# Altium project MainBoard.PrjPcb
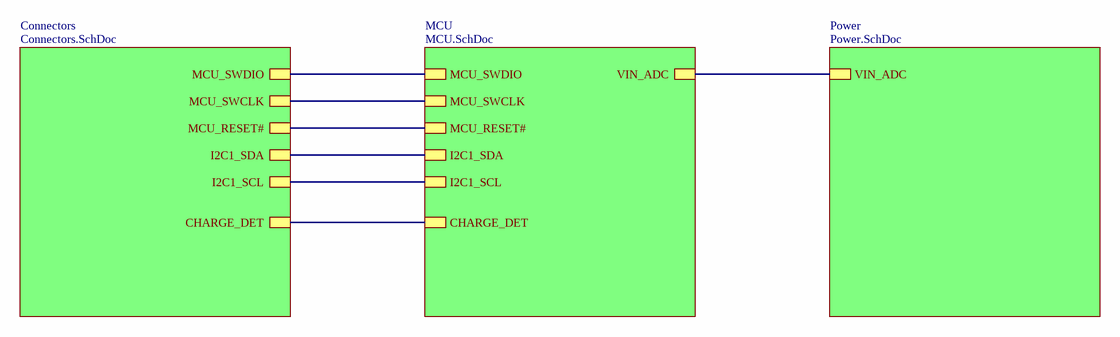
[diagram p0: Main.SchDoc]
ProjectAuthor: NeoProg; ProjectRevision: 1.00; ProjectStatus: D
4 sheets, 43 parts. Net scope: hierarchical (ports join the sheet entries above them; power ports are global).
Board file: PCB.PcbDoc
Sheets:
  Main.SchDoc
    Connectors = Connectors.SchDoc
    MCU = MCU.SchDoc
    Power = Power.SchDoc

## Sheet Main.SchDoc
size A3; SheetNumber: 1; SheetTotal: 1

### Sub-sheets
Connectors = Connectors.SchDoc: MCU_SWDIO, MCU_SWCLK, MCU_RESET#, CHARGE_DET, I2C1_SDA, I2C1_SCL
MCU = MCU.SchDoc: MCU_SWDIO, MCU_SWCLK, MCU_RESET#, VIN_ADC, CHARGE_DET, I2C1_SDA, I2C1_SCL
Power = Power.SchDoc: VIN_ADC

### Nets
CHARGE_DET: sheet Connectors/CHARGE_DET, sheet MCU/CHARGE_DET
I2C1_SCL: sheet Connectors/I2C1_SCL, sheet MCU/I2C1_SCL
I2C1_SDA: sheet Connectors/I2C1_SDA, sheet MCU/I2C1_SDA
MCU_RESET#: sheet Connectors/MCU_RESET#, sheet MCU/MCU_RESET#
MCU_SWCLK: sheet Connectors/MCU_SWCLK, sheet MCU/MCU_SWCLK
MCU_SWDIO: sheet Connectors/MCU_SWDIO, sheet MCU/MCU_SWDIO
VIN_ADC: sheet MCU/VIN_ADC, sheet Power/VIN_ADC

## Sheet Connectors.SchDoc
size A4; SheetNumber: 1; SheetTotal: 1
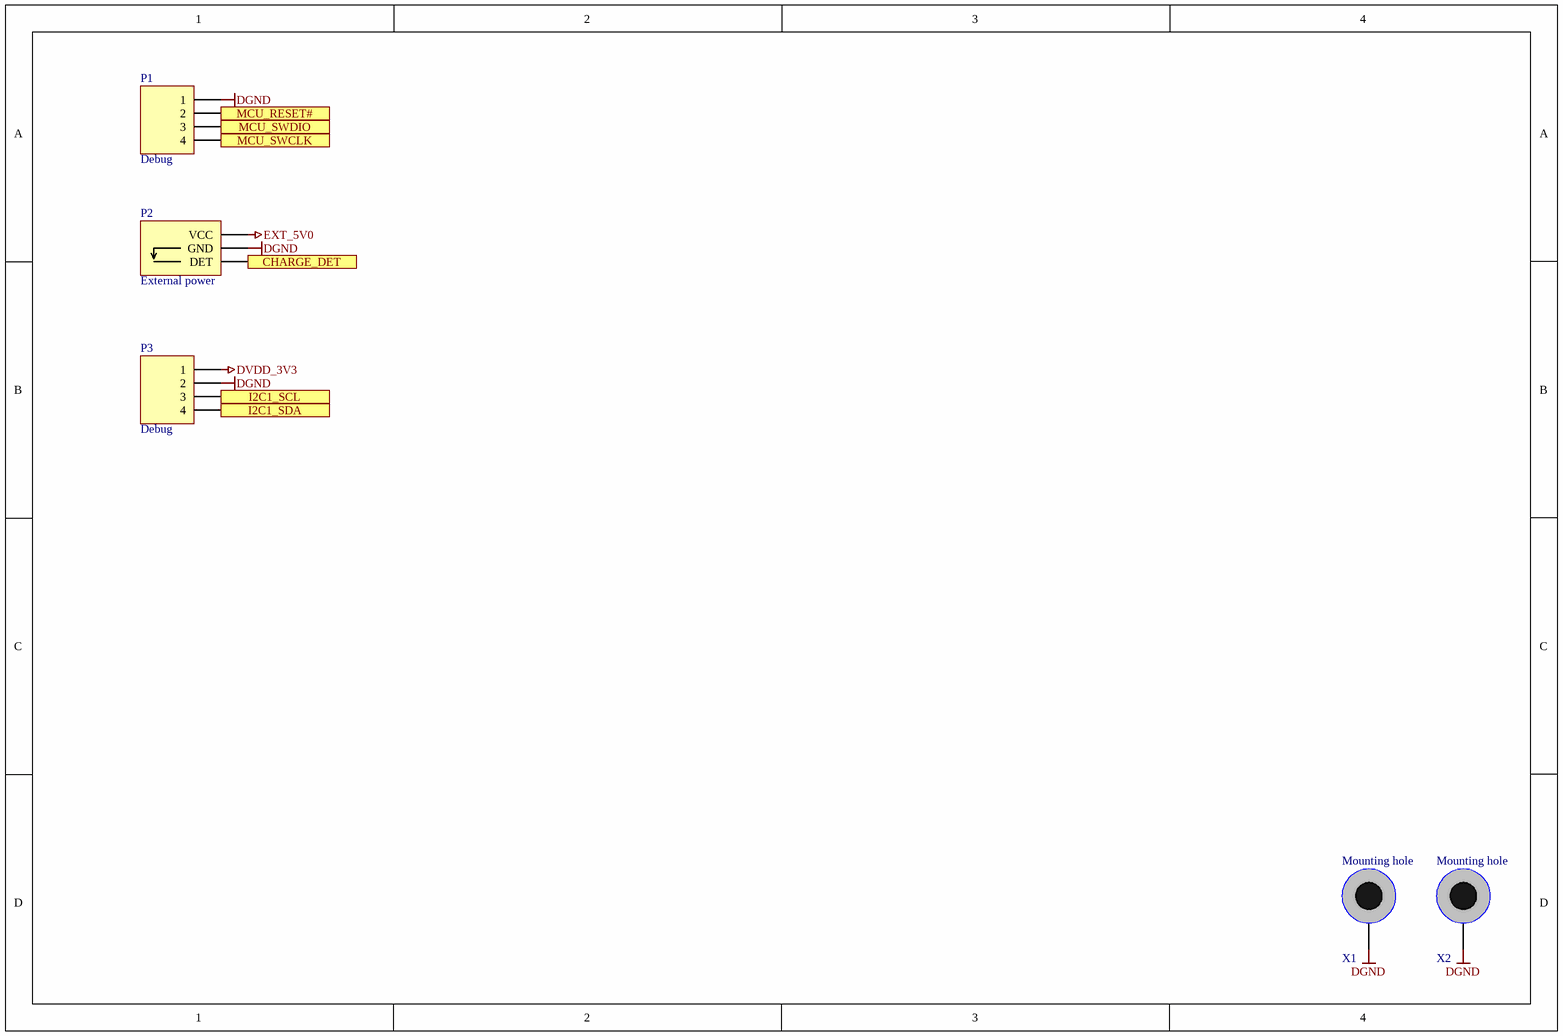
[diagram p1: Connectors.SchDoc]

### Parts
P1  Debug  [PLS-4 2.54]
P2  External power  [DC-210]
P3  Debug  [PLS-4 2.54]
X1  Mounting hole  [HOLE_M2_D4.0/2.5]  (no BOM)
X2  Mounting hole  [HOLE_M2_D4.0/2.5]  (no BOM)

### Ports
CHARGE_DET, I2C1_SCL, I2C1_SDA, MCU_RESET#, MCU_SWCLK, MCU_SWDIO

### Nets
DGND: P1.1 P2.2(GND) P3.2 X1.1 X2.1
DVDD_3V3: P3.1
EXT_5V0: P2.1(VCC)
CHARGE_DET: P2.3(DET) ; port CHARGE_DET
I2C1_SCL: P3.3 ; port I2C1_SCL
I2C1_SDA: P3.4 ; port I2C1_SDA
MCU_RESET#: P1.2 ; port MCU_RESET#
MCU_SWCLK: P1.4 ; port MCU_SWCLK
MCU_SWDIO: P1.3 ; port MCU_SWDIO

### Library data of the parts
P1 P3 = Header 4: Header, 4-Pin; LatestRevisionDate: 17-Jul-2002; LatestRevisionNote: Re-released for DXP Platform.; Publisher: Altium Limited
P2 = DC-210: Power connector 3.5mm; LatestRevisionDate: 17-Jul-2002; LatestRevisionNote: Re-released for DXP Platform.; Publisher: Altium Limited
X1 X2 = Mounting hole: Hole for screw M3, outline D6

## Sheet MCU.SchDoc
size A4; SheetNumber: 1; SheetTotal: 1
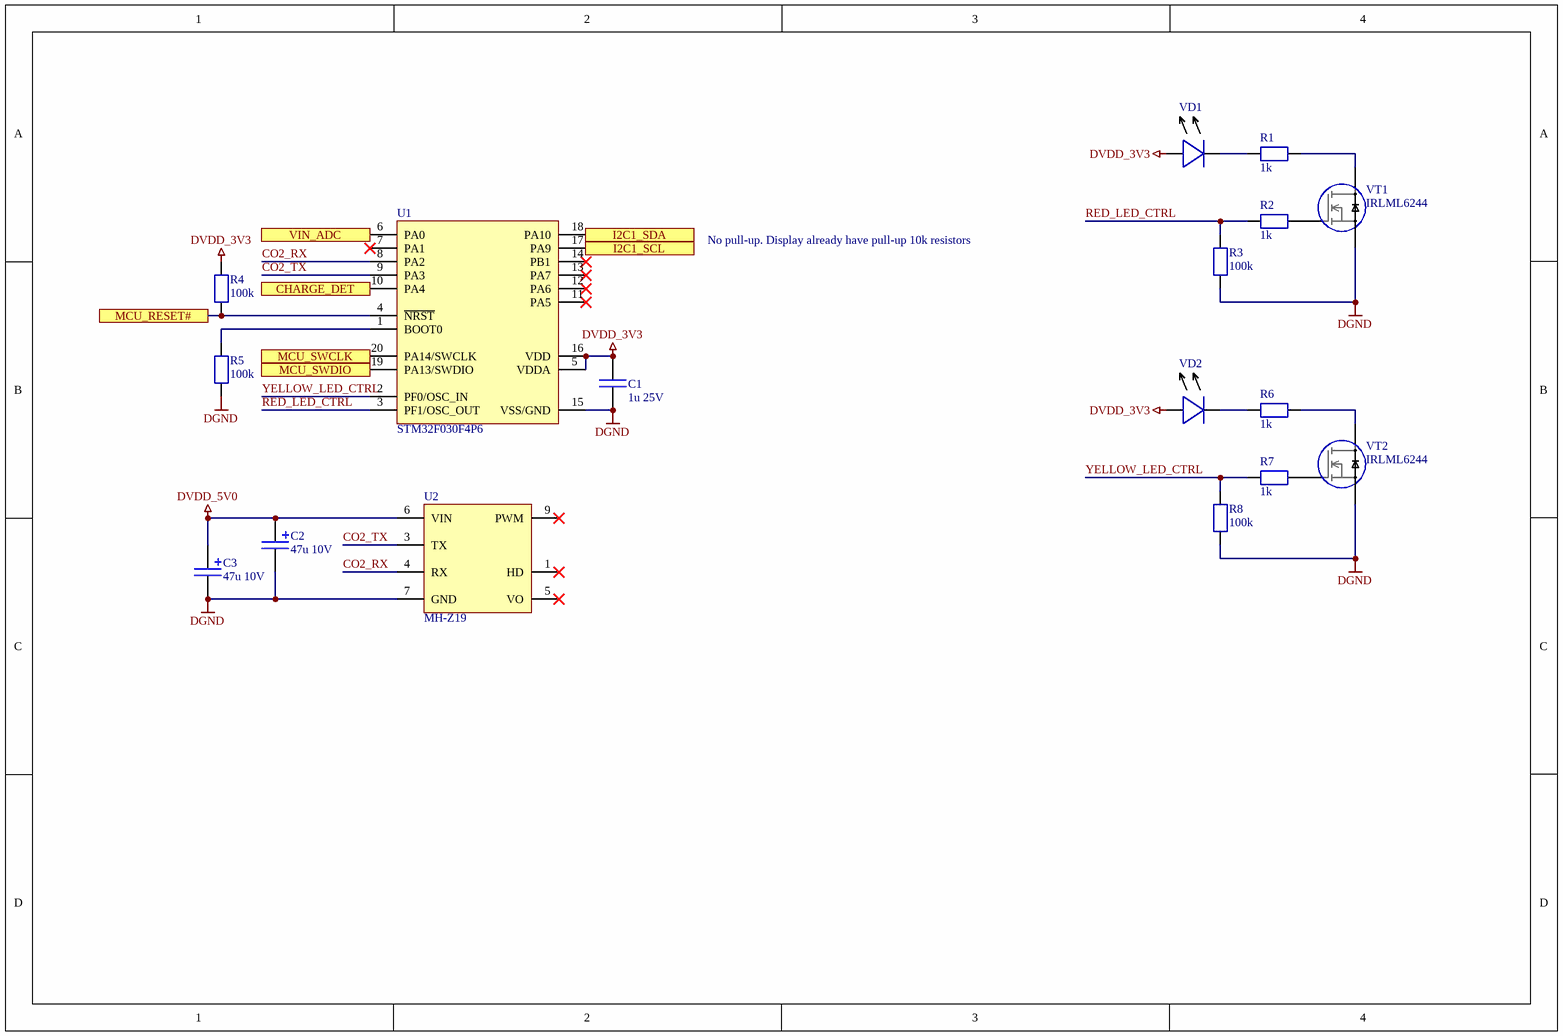
[diagram p2: MCU.SchDoc]

### Parts
C1  1u 25V  [C_0603/1608]
C2  47u 10V  [TECAP_TYPE_B]
C3  47u 10V  [TECAP_TYPE_B]
R1  1k  [R_0603/1608]
R2  1k  [R_0603/1608]
R3  100k  [R_0603/1608]
R4  100k  [R_0603/1608]
R5  100k  [R_0603/1608]
R6  1k  [R_0603/1608]
R7  1k  [R_0603/1608]
R8  100k  [R_0603/1608]
U1  STM32F030F4P6  [SO20_0.65]
U2  MH-Z19  [MH-Z19]
VD1  (no value)  [PLS-2 2.54]
VD2  (no value)  [PLS-2 2.54]
VT1  IRLML6244  [SOT23-3]
VT2  IRLML6244  [SOT23-3]

### Ports
CHARGE_DET, I2C1_SCL, I2C1_SDA, MCU_RESET#, MCU_SWCLK, MCU_SWDIO, VIN_ADC

### Nets
DGND: C1.2 C2.2(NEG) C3.2(NEG) R3.1 R5.1 R8.1 U1.15(VSS/GND) U2.7(GND) VT1.S VT2.S
DVDD_3V3: C1.1 R4.1 U1.5(VDDA) U1.16(VDD) VD1.A VD2.A
DVDD_5V0: C2.1(POS) C3.1(POS) U2.6(VIN)
CHARGE_DET: U1.10(PA4) ; port CHARGE_DET
CO2_RX: U1.8(PA2) U2.4(RX)
CO2_TX: U1.9(PA3) U2.3(TX)
I2C1_SCL: U1.17(PA9) ; port I2C1_SCL
I2C1_SDA: U1.18(PA10) ; port I2C1_SDA
MCU_RESET#: R4.2 U1.4(~{NRST}) ; port MCU_RESET#
MCU_SWCLK: U1.20(PA14/SWCLK) ; port MCU_SWCLK
MCU_SWDIO: U1.19(PA13/SWDIO) ; port MCU_SWDIO
RED_LED_CTRL: R2.2 R3.2 U1.3(PF1/OSC_OUT)
VIN_ADC: U1.6(PA0) ; port VIN_ADC
YELLOW_LED_CTRL: R7.2 R8.2 U1.2(PF0/OSC_IN)
NetR1_1: R1.1 VT1.D
NetR1_2: R1.2 VD1.C
NetR2_1: R2.1 VT1.G
NetR5_2: R5.2 U1.1(BOOT0)
NetR6_1: R6.1 VT2.D
NetR6_2: R6.2 VD2.C
NetR7_1: R7.1 VT2.G

Not connected (* = marked no-connect by the designer): U1 0(EP) 7(PA1)* 11(PA5)* 12(PA6)* 13(PA7)* 14(PB1)*; U2 0(EP) 1(HD)* 5(VO)* 9(PWM)*

### Notes on the sheet
- No pull-up. Display already have pull-up 10k resistors

### Library data of the parts
C1 = Capacitor: Non-polarized capacitor
C2 C3 = Capacitor polar: Polarized capacitor
R1-R8 = Resistor
U1 = STM32F030F: 32-bit Cortex-M0
U2 = MH-Z19: CO2 sensor
VD1 VD2 = LED: pin to pad: A>1 C>2
VT1 VT2 = MOSFET N: pin to pad: D>3 G>1 S>2

## Sheet Power.SchDoc
size A4; SheetNumber: 1; SheetTotal: 1
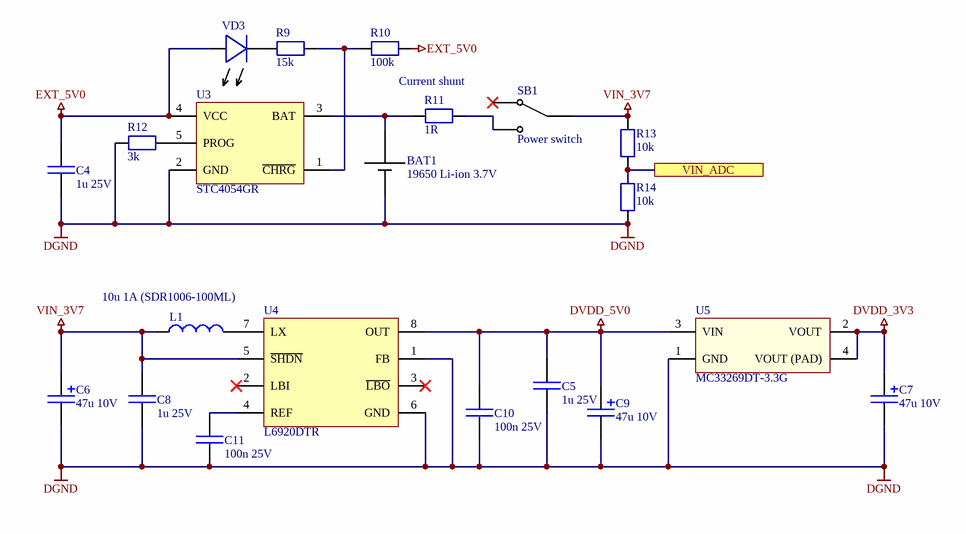
[diagram p3: Power.SchDoc]

### Parts
BAT1  19650 Li-ion 3.7V  [PLS-2 2.54]
C4  1u 25V  [C_0603/1608]
C5  1u 25V  [C_0603/1608]
C6  47u 10V  [TECAP_TYPE_B]
C7  47u 10V  [TECAP_TYPE_B]
C8  1u 25V  [C_0603/1608]
C9  47u 10V  [TECAP_TYPE_B]
C10  100n 25V  [C_0603/1608]
C11  100n 25V  [C_0603/1608]
L1  10u 1A (SDR1006-100ML)  [L_1006]
R9  15k  [R_0603/1608]
R10  100k  [R_0603/1608]
R11  1R  [R_0603/1608]
R12  3k  [R_0603/1608]
R13  10k  [R_0603/1608]
R14  10k  [R_0603/1608]
SB1  Power switch  [KBB40_2P2W]
U3  STC4054GR  [SOT23-5]
U4  L6920DTR  [SO8_0.65]
U5  MC33269DT-3.3G  [TO252AA/DPAK]
VD3  (no value)  [PLS-2 2.54]

### Ports
VIN_ADC

### Nets
DGND: BAT1.1 C4.2 C5.2 C6.2(NEG) C7.2(NEG) C8.2 C9.2(NEG) C10.2 C11.2 R12.2 R14.1 U3.2(GND) U4.1(FB) U4.6(GND) U5.1(GND)
DVDD_3V3: C7.1(POS) U5.2(VOUT) U5.4(VOUT_(PAD))
DVDD_5V0: C5.1 C9.1(POS) C10.1 U4.8(OUT) U5.3(VIN)
EXT_5V0: C4.1 R10.2 U3.4(VCC) VD3.A
VIN_3V7: C6.1(POS) C8.1 L1.1 R13.2 SB1.1 U4.5(~{SHDN})
VIN_ADC: R13.1 R14.2 ; port VIN_ADC
NetBAT1_2: BAT1.2 R11.2 U3.3(BAT)
NetC11_1: C11.1 U4.4(REF)
NetL1_2: L1.2 U4.7(LX)
NetR9_1: R9.1 R10.1 U3.1(~{CHRG})
NetR9_2: R9.2 VD3.C
NetR11_1: R11.1 SB1.3
NetR12_1: R12.1 U3.5(PROG)

Not connected (* = marked no-connect by the designer): SB1 2*; U4 2(LBI)* 3(~{LBO})*

### Notes on the sheet
- Current shunt

### Library data of the parts
BAT1 = Battery
C4 C5 C8 C10 C11 = Capacitor: Non-polarized capacitor
C6 C7 C9 = Capacitor polar: Polarized capacitor
L1 = Inductor
R9-R14 = Resistor
SB1 = Switch 3-pin
U3 = STC4054GR: Li-ion charger
U4 = L6920DTR: DC-DC step-up switching regulator
U5 = LM1117: LDO voltage regulator; pin to pad: 2>3 3>2 4>3
VD3 = LED: pin to pad: A>1 C>2

## Nets that join several sheets
DGND: Connectors (5 pins), MCU (10 pins), Power (15 pins)
DVDD_3V3: Connectors (P3.1), MCU (6 pins), Power (C7.1 U5.2 U5.4)
DVDD_5V0: MCU (C2.1 C3.1 U2.6), Power (5 pins)
EXT_5V0: Connectors (P2.1), Power (C4.1 R10.2 U3.4 VD3.A)
CHARGE_DET: Connectors (P2.3), MCU (U1.10)
I2C1_SCL: Connectors (P3.3), MCU (U1.17)
I2C1_SDA: Connectors (P3.4), MCU (U1.18)
MCU_RESET#: Connectors (P1.2), MCU (R4.2 U1.4)
MCU_SWCLK: Connectors (P1.4), MCU (U1.20)
MCU_SWDIO: Connectors (P1.3), MCU (U1.19)
VIN_ADC: MCU (U1.6), Power (R13.1 R14.2)

## Assembly variants
Base: all parts fitted